# EAGLE design V1 (EAGLE 9.6.2)
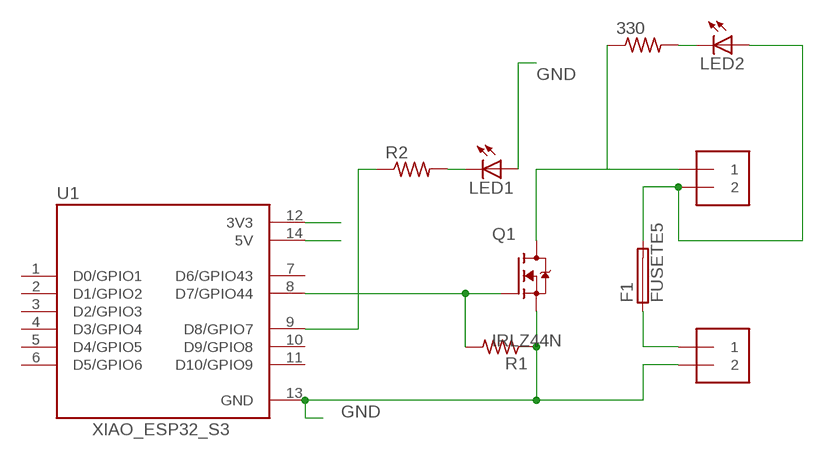
[diagram p0: schematic, sheet 1]

## Parts
330  R-US_0204/7  [0204/7]
F1  FUSETE5  [TE5]
J1  1X2-3.5MM  [1X2-3.5MM]
J2  1X2-3.5MM  [1X2-3.5MM]
LED1  LED5MM  [LED5MM]
LED2  LED5MM  [LED5MM]
Q1  IRLZ44N  [TO254P1054X469X1930-3]
R1  R-US_0204/7  [0204/7]
R2  R-US_0204/7  [0204/7]
U1  XIAO_ESP32_S3  [MODULE_XIAO_ESP32_S3]

## Nets
GND: J2.2 LED1.A Q1.3(S) R1.1 U1.13(GND)
N$1: U1.12(3V3)
N$2: U1.14(5V)
N$3: R2.1 U1.9(D8/GPIO7)
N$4: Q1.1(G) R1.2 U1.8(D7/GPIO44)
N$5: 330.1 J1.1 Q1.2(D)
N$6: F1.2 J1.2 LED2.A
N$7: F1.1 J2.1
N$8: 330.2 LED2.K(C)
N$9: LED1.K(C) R2.2
Unconnected: U1.1(D0/GPIO1) U1.2(D1/GPIO2) U1.3(D2/GPIO3) U1.4(D3/GPIO4) U1.5(D4/GPIO5) U1.6(D5/GPIO6) U1.7(D6/GPIO43) U1.10(D9/GPIO8) U1.11(D10/GPIO9)

## Library data of the parts
330 R1 R2 = adafruit:R-US_: RESISTOR, American symbol
F1 = fuse:FUSE: Fuse; OC_FARNELL: unknown; OC_NEWARK: unknown
J1 J2 = adafruit:1X2: 3.5mm Terminal block http://www.ladyada.net/library/pcb/eaglelibrary.html
LED1 LED2 = adafruit:LED: LED OSRAM: - CHIPLED LG R971, LG N971, LY N971, LG Q971, LY Q971, LO R971, LY R971 LH N974, LH R974 LS Q976, LO Q976, LY Q976 LO Q996 - Hyper CHIPLED LW Q18S LB Q993, LB Q99A, LB R99A - SideLED LS A670, LO A670, LY A670, LG A670, LP A670 LB A673, LV A673, LT A673, LW A673 LH A674 LY A675 LS A676, LA A676, LO A676, LY A676, LW A676 LS A679, LY A679, LG A679 - Hyper Micro SIDELED® LS Y876, LA Y876, LO Y876, LY Y876 LT Y87S - SmartLED LW L88C, LW L88S LB L89C, LB L89S, LG L890 LS L89K, LO L89K, LY L89K LS L896, LA L896, LO L896, LY L896 - TOPLED LS T670, LO T670, LY T670, LG T670, LP T670 LSG T670, LSP T670, LSY T670, LOP T670, LYG T670 LG T671, LOG T671, LSG T671 LB T673, LV T673, LT T673, LW T673 LH T674 LS T676, LA T676, LO T676, LY T676, LB T676, LH T676, LSB T676, LW T676 LB T67C, LV T67C, LT T67C, LS T67K, LO T67K, LY T67K, LW E67C LS E67B, LA E67B, LO E67B, LY E67B, LB E67C, LV E67C, LT E67C LW T67C LS T679, LY T679, LG T679 LS T770, LO T770, LY T770, LG T770, LP T770 LB T773, LV T773, LT T773, LW T773 LH T774 LS E675, LA E675, LY E675, LS T675 LS T776, LA T776, LO T776, LY T776, LB T776 LHGB T686 LT T68C, LB T68C - Hyper Mini TOPLED® LB M676 - Mini TOPLED Santana® LG M470 LS M47K, LO M47K, LY M47K Source: http://www.osram.convergy.de/
Q1 = IRLZ44N:IRLZ44N: Check availability <https://pricing.snapeda.com/parts/IRLZ44N/Infineon%20Technologies/view-part?ref=eda>; AVAILABILITY: Not in stock; CHECK_PRICES: https://www.snapeda.com/parts/IRLZ44N/Infineon/view-part/?ref=eda; DESCRIPTION: N-Channel 55 V 47A (Tc) 3.8W (Ta), 110W (Tc) Surface Mount D2PAK; MF: Infineon Technologies; MP: IRLZ44N; PACKAGE: TO-220 Infineon; PRICE: None; PURCHASE-URL: https://www.snapeda.com/api/url_track_click_mouser/?unipart_id=1618993&manufacturer=Infineon Technologies&part_name=IRLZ44N&search_term=irlz44n; SNAPEDA_LINK: https://www.snapeda.com/parts/IRLZ44N/Infineon/view-part/?ref=snap
U1 = XIAO_ESP32_S3:XIAO_ESP32_S3: Check availability <https://pricing.snapeda.com/parts/XIAO%20ESP32%20S3/Seeed%20Studio/view-part?ref=eda>; AVAILABILITY: Not in stock; CHECK_PRICES: https://www.snapeda.com/parts/XIAO%20ESP32%20S3/Seeed+Studio/view-part/?ref=eda; DESCRIPTION: Seeed Studio XIAO ESP32-S3 Development Board Supports Wi-Fi & Bluetooth; MF: Seeed Studio; MP: XIAO ESP32 S3; PACKAGE: None; PRICE: None; SNAPEDA_LINK: https://www.snapeda.com/parts/XIAO%20ESP32%20S3/Seeed+Studio/view-part/?ref=snap

## Board
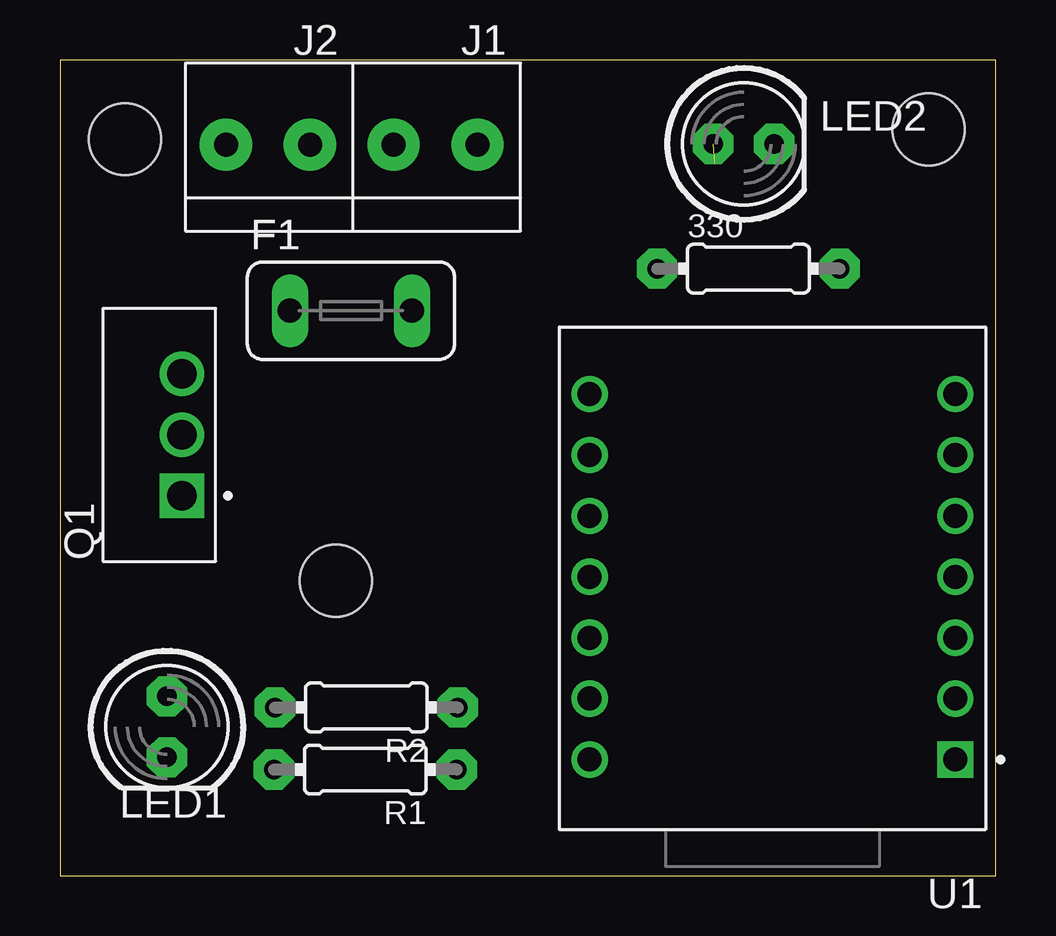
[diagram p1: board, top side]
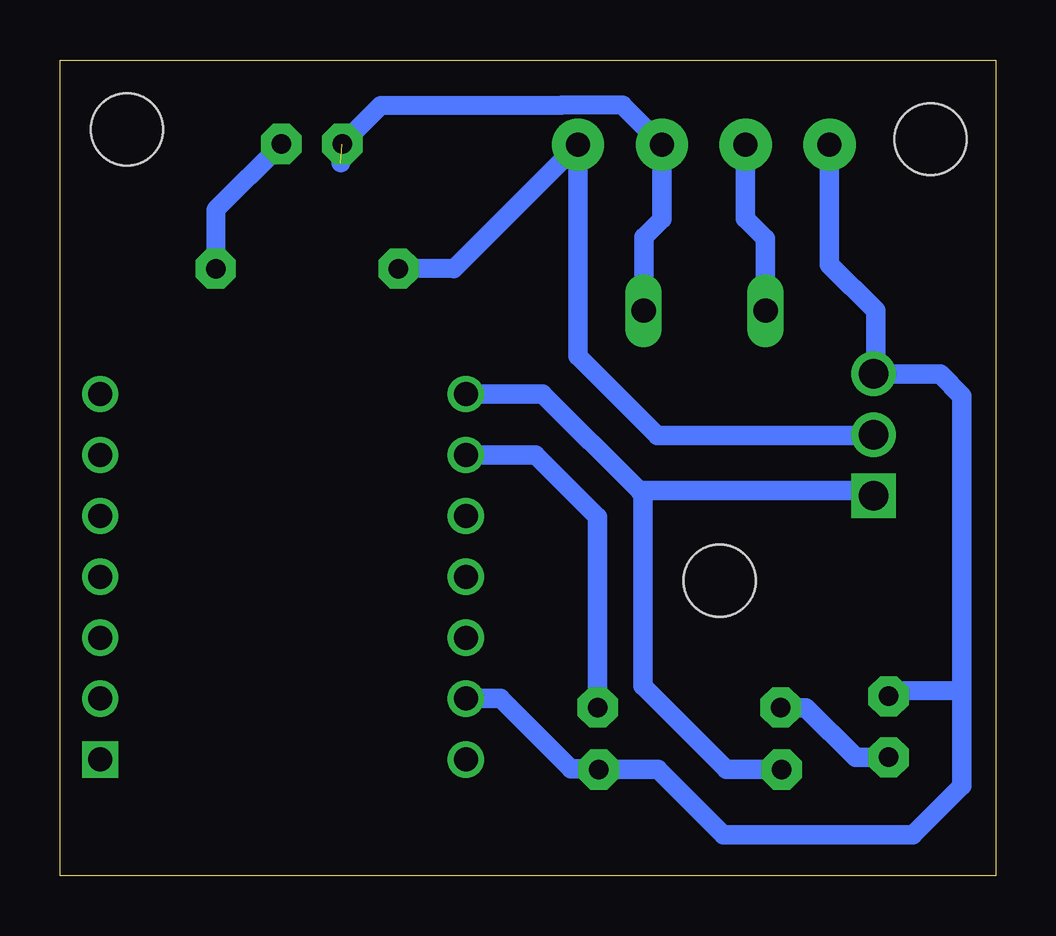
[diagram p2: board, bottom side, seen from below]

Size 39 x 34 mm. Coordinates in mm from the lower left corner, seen from the top.
Outline: 0,0 39,0 39,34 0,34 0,0
Copper layers (1*16): Top 0.035mm / dielectric 1.5mm / Bottom 0.035mm
Design rules "default": minimum track width 6mil, minimum drill 0.35mm, track to track 6mil, track to pad 6mil, pad to pad 6mil, via to via 6mil, smd to smd 6mil, copper to edge 40mil, drill to drill 6mil, minimum pad ring 10mil, minimum via ring 8mil, stop-mask expansion 4mil, vias tented up to drill 0mil, thermal gap 10mil
Holes 3 mm at 2.7,30.7 36.2,31.1 11.5,12.3

### Footprints (pad centres in the part's own frame; a part is rotated, then mirrored left to right if it is on the bottom)
0204/7 = drill 0.813 pad 1.676 octagon: 1 -3.81,0; 2 3.81,0
TE5 = drill 1.016 long: 1 -2.54,0; 2 2.54,0
1X2-3.5MM = drill 1 pad 2.184: 1 1.8,0; 2 -1.7,0
LED5MM = drill 0.813 pad 1.676 octagon: A -1.27,0; K 1.27,0
TO254P1054X469X1930-3 = drill 1.23 pad 1.85 square: 1 -2.54,-0.94 | drill 1.23 pad 1.85: 2 0,-0.94; 3 2.54,-0.94
MODULE_XIAO_ESP32_S3 = drill 1 square: 1 -7.62,7.556 | drill 1: 2 -7.62,5.016; 3 -7.62,2.477; 4 -7.62,-0.064; 5 -7.62,-2.603; 6 -7.62,-5.144; 7 -7.62,-7.684; 8 7.62,-7.684; 9 7.62,-5.144; 10 7.62,-2.603; 11 7.62,-0.064; 12 7.62,2.477; 13 7.62,5.016; 14 7.62,7.556

### Placement (x,y rotation side)
330  28.7,25.3 0 top
F1  12.13,23.55 0 top
J1  15.61,30.47 0 top
J2  8.62,30.47 0 top
LED1  4.46,6.2 270 top
LED2  28.5,30.5 0 top
Q1  4.14,18.37 90 top
R1  12.73,4.42 180 top
R2  12.77,7.01 180 top
U1  29.7,12.39 180 top

### Tracks (layer width: path | path; a pad name or v marks a point on that pad's centre or on a via)
GND
  Bottom 0.8: 1.4,7.7 4.23,7.7 LED1.A
  Bottom 0.813: U1.13 20.62,7.38 17.7,4.45 16.58,4.45 R1.1 14.07,4.42 11.35,1.7 3.45,1.7 1.4,3.75 1.4,7.7 1.4,20 2.31,20.91 Q1.3 5,20.96 5,23.55 6.92,25.47 J2.2
N$3
  Bottom 0.813: U1.9 19.19,17.54 16.6,14.95 16.6,7.03 R2.1
N$4
  Bottom 0.813: U1.8 18.88,20.08 14.85,16.05 14.7,16.05 | 14.7,16.05 5.3,16.05 Q1.1 | R1.2 11.22,4.42 14.7,7.9 14.7,16.05
N$5
  Bottom 0.8: J1.1 22.57,25.3 330.1
  Bottom 0.813: Q1.2 5.1,18.35 14.1,18.35 17.41,21.66 J1.1
N$6  (1 unrouted)
  Bottom 0.8: J1.2 15.55,32.12 18.09,32.12 18.1,32.1 25.63,32.1 27.3,30.43 27.3,29.7
  Bottom 0.813: F1.2 14.65,23.57 14.65,26.62 13.9,27.37 J1.2
N$7
  Bottom 0.813: F1.1 9.59,26.55 10.42,27.38 J2.1
N$8
  Bottom 0.8: LED2.K 32.51,27.76 330.2
N$9
  Bottom 0.813: LED1.K 5.83,4.93 7.9,7 R2.2